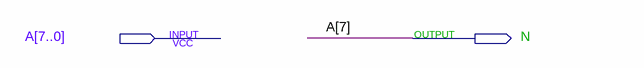
[diagram p0: schematic sheet]
// Quartus schematic Flag_N_8b.bdf as structural Verilog: 0 symbols, 2 pins
module Flag_N_8b (
  input  [7:0] A,
  output N
);


  assign N = A[7];
endmodule
